# EasyEDA Pro project ProPrj_PRISM101 Scanner Backlight_2026-04-10.epro, board PRISM101 Backlight 4x4 RGBW 20260317
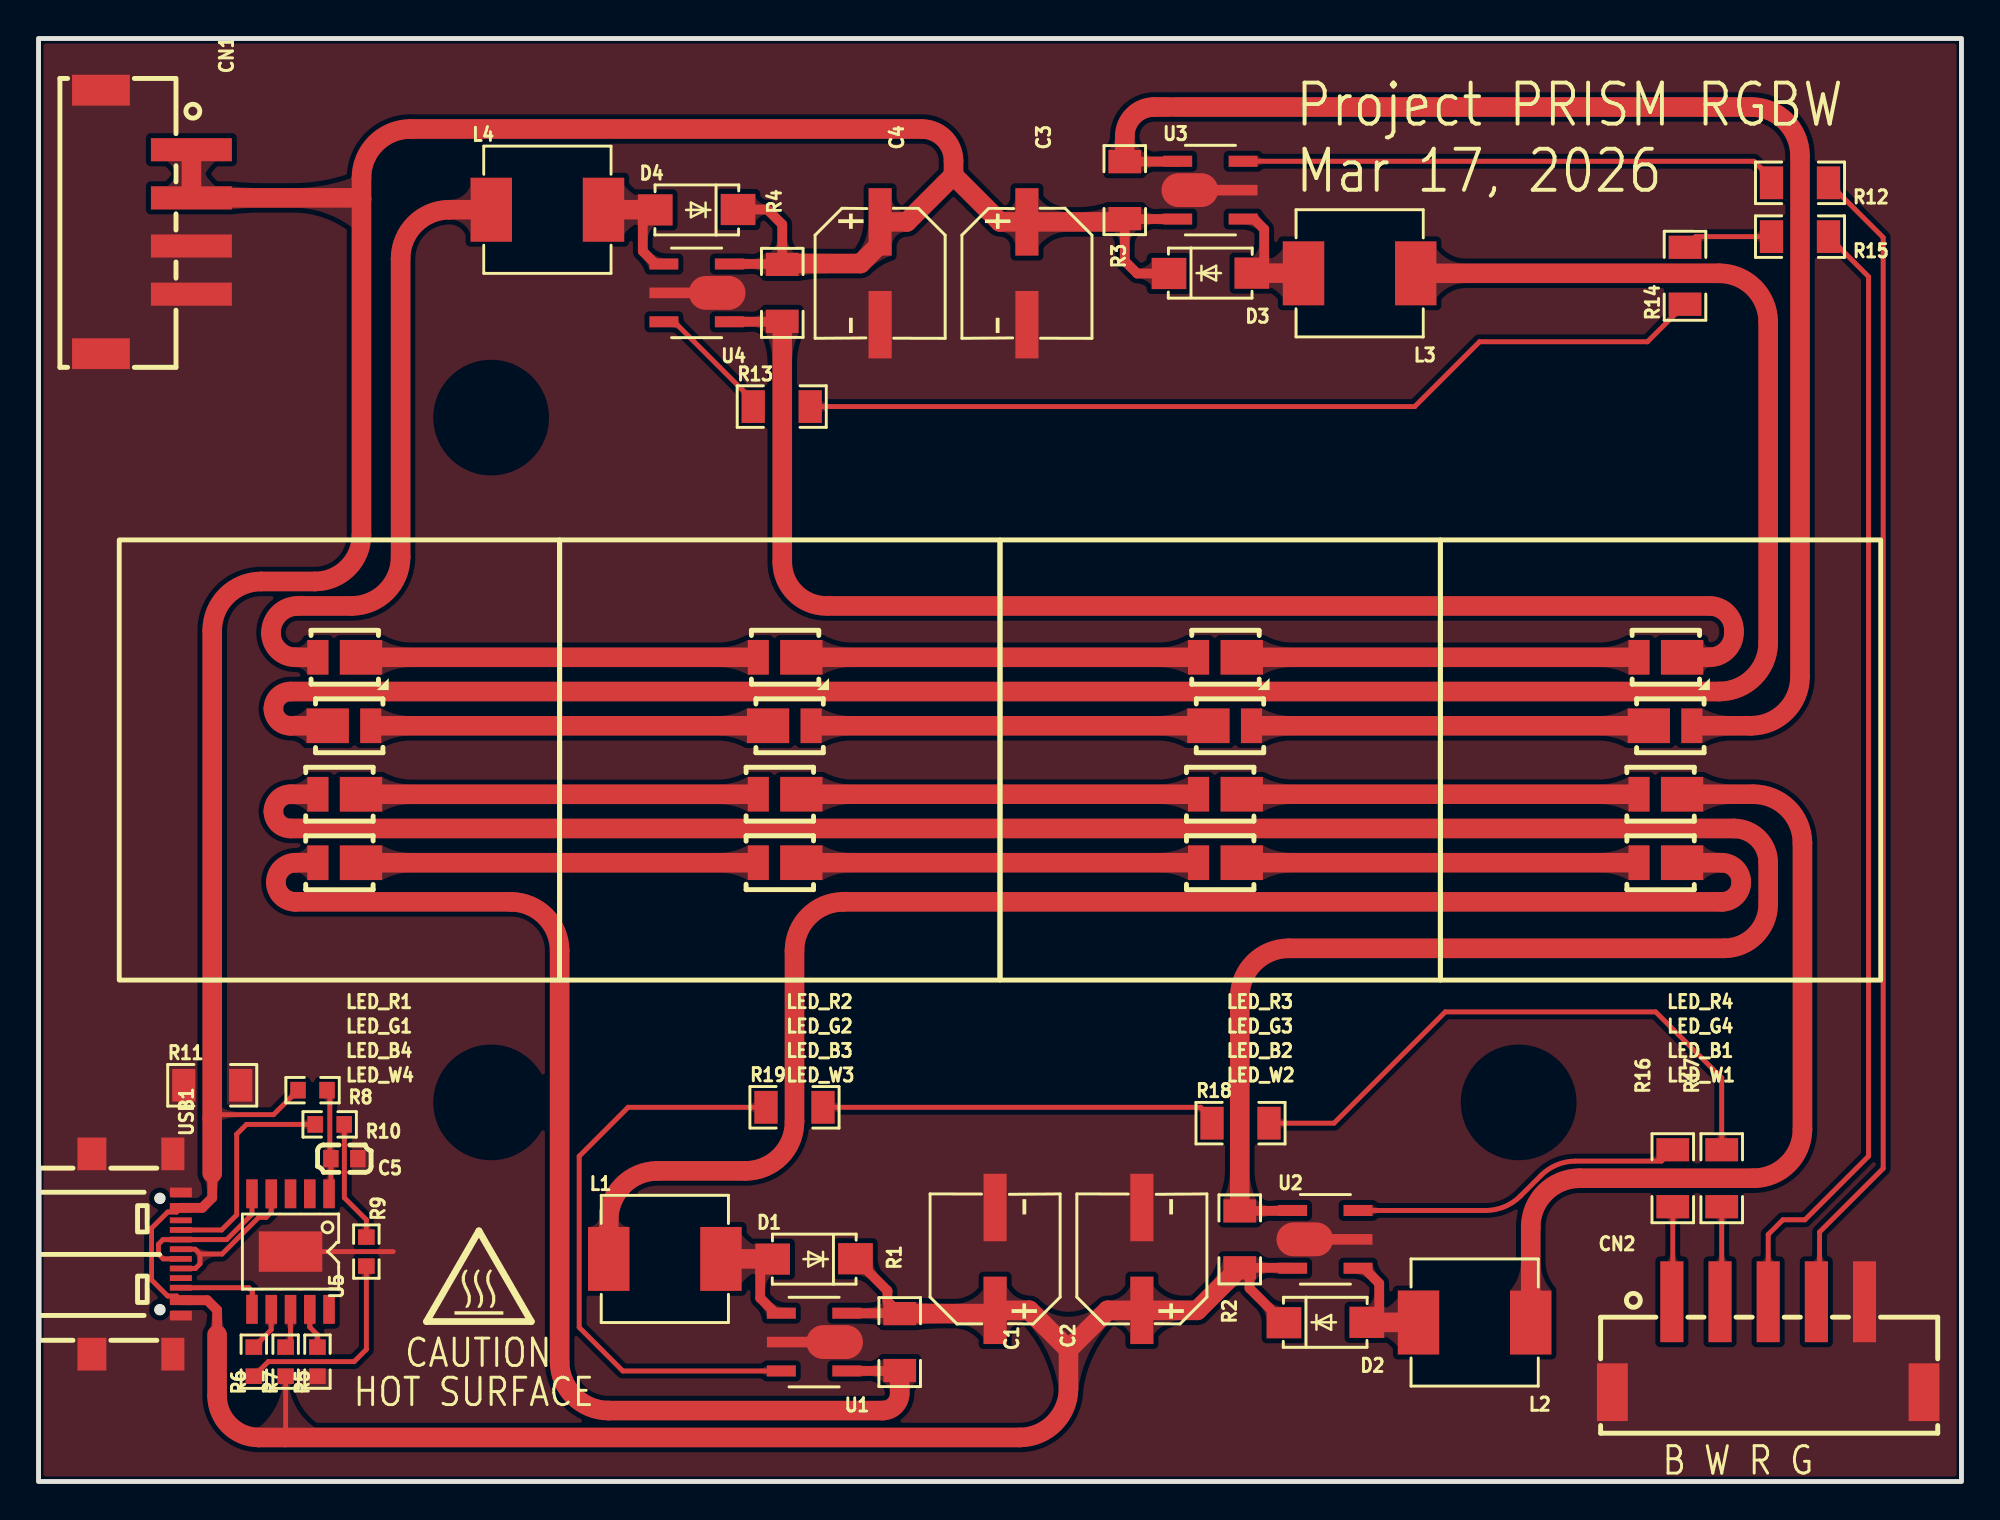
[diagram p3: board, top side]
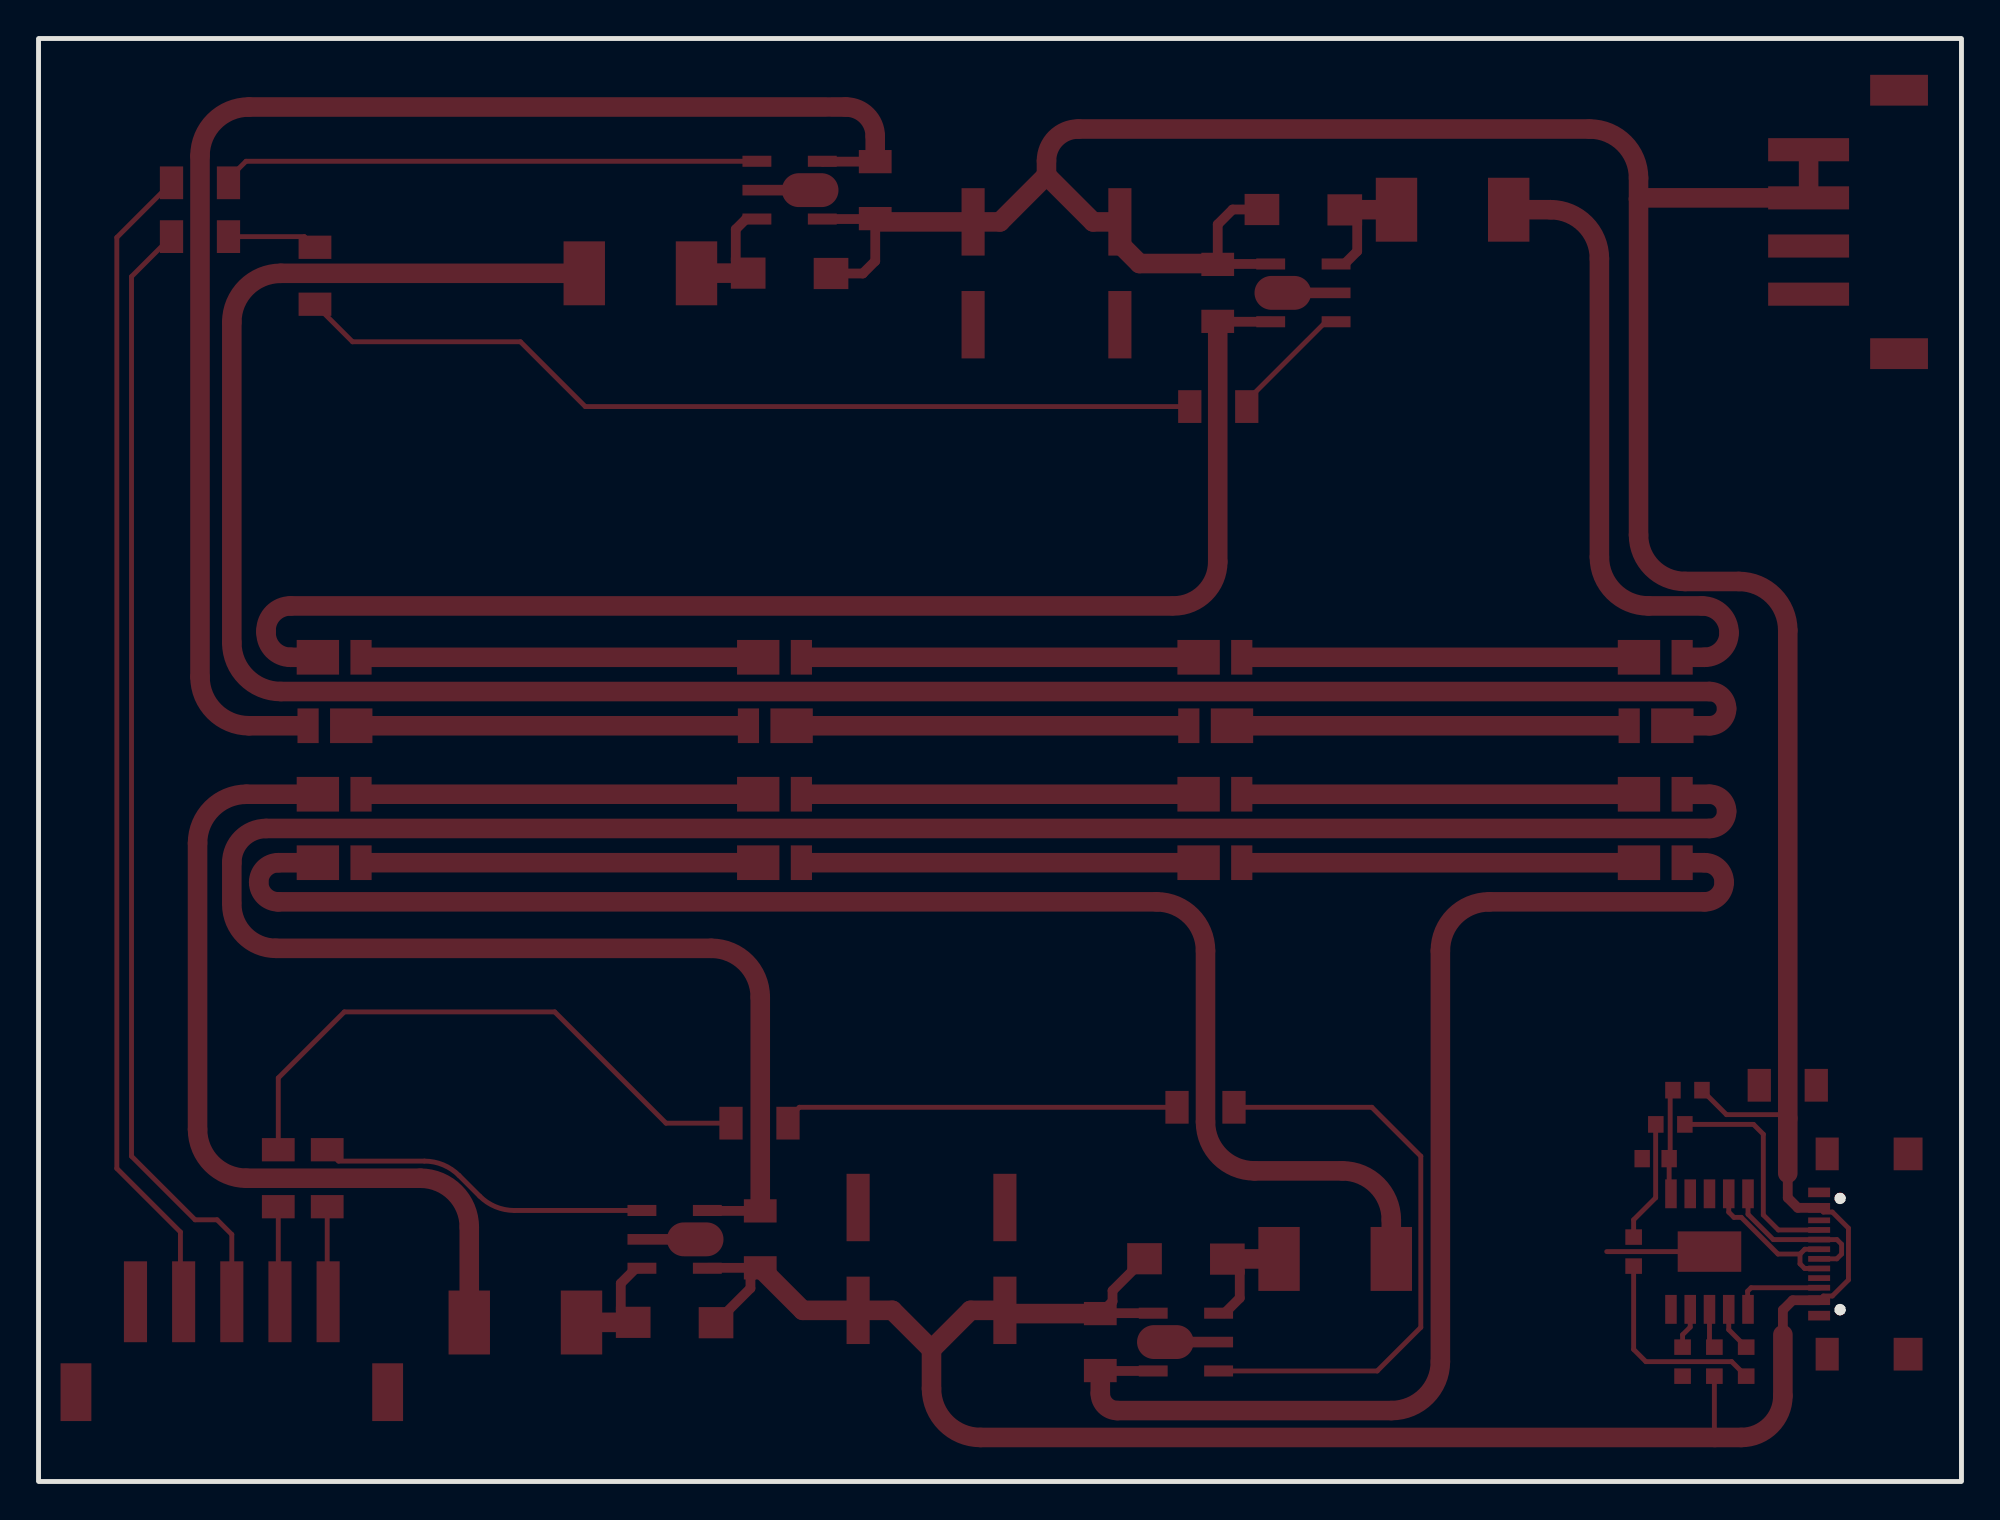
[diagram p4: board, bottom side, seen from below]

Outline 99.82 x 74.93 mm; copper layers: Top Layer, Bottom Layer. Coordinates in mm from the lower left corner of the outline.
Outline path: rectangle 0,74.93 99.82,0
Stack: Top Layer 0.035mm / Dielectric1 1.51mm FR4 er 4.5 / Bottom Layer 0.035mm

## Design rules (mm)
spacing copperThickness1oz (default): track to track 0.102, other pairs 0.152 to 0.3
spacing copperThickness2oz: track to track 0.203, other pairs 0.152 to 0.3
track width copperThickness1oz (default): min 0.127, default 0.254, max 2.54
track width copperThickness2oz: min 0.203, default 0.254, max 2.54
differential pair differentialPair (default): width min 0.127, default 0.254, max 2.54; gap min 0.152, default 0.152

## Placement (name value [footprint] x y rotation side)
C1  100uF  [CAP-SMD_BD6.3-L6.6-W6.6-LS7.3-FD-H7.7]  49.66 11.56 90 top
C2  100uF  [CAP-SMD_BD6.3-L6.6-W6.6-LS7.3-FD-H7.7]  57.28 11.56 90 top
C3  100uF  [CAP-SMD_BD6.3-L6.6-W6.6-LS7.3-FD-H7.7]  51.31 62.74 270 top
C4  100uF  [CAP-SMD_BD6.3-L6.6-W6.6-LS7.3-FD-H7.7]  43.69 62.74 270 top
C5  1uF  [C0603]  15.88 16.76 0 top
CN1  UK-2.54-4ALT  [CONN-SMD_UK-2.54-4ALT]  5.59 65.41 270 top
CN2  UK-2.54-5ALT  [CONN-SMD_5P-P2.50_UK-2.54-5ALT]  89.79 6.99 0 top
D1  SS36  [SMA_L4.3-W2.6-LS5.0-FD]  40.26 11.56 0 top
D2  SS36  [SMA_L4.3-W2.6-LS5.0-FD]  66.8 8.25 180 top
D3  SS36  [SMA_L4.3-W2.6-LS5.0-FD]  60.83 62.74 180 top
D4  SS36  [SMA_L4.3-W2.6-LS5.0-FD]  34.16 66.04 0 top
HOTSURFACE  CAUTION HOT SURFACE  [IEC_HotSurface_Small]  22.86 10.67 0 top
L1  68uH  [IND-SMD_L7.1-W6.6_H5.0]  32.51 11.56 0 top
L2  68uH  [IND-SMD_L7.1-W6.6_H5.0]  74.55 8.25 180 top
L3  68uH  [IND-SMD_L7.1-W6.6_H5.0]  68.58 62.74 180 top
L4  68uH  [IND-SMD_L7.1-W6.6_H5.0]  26.42 66.04 0 top
LED_B1  JE2835ARY-N-0002A0000-N0000001  [LED-SMD_L3.5-W2.8-JE2835BWT-N]  84.2 35.69 180 top
LED_B2  JE2835ARY-N-0002A0000-N0000001  [LED-SMD_L3.5-W2.8-JE2835BWT-N]  61.34 35.69 180 top
LED_B3  JE2835ARY-N-0002A0000-N0000001  [LED-SMD_L3.5-W2.8-JE2835BWT-N]  38.48 35.69 180 top
LED_B4  JE2835ARY-N-0002A0000-N0000001  [LED-SMD_L3.5-W2.8-JE2835BWT-N]  15.62 35.69 180 top
LED_G1  JE2835AGR-N-0002A0000-N0000001  [LED-SMD_L3.5-W2.8-JE2835BWT-N]  16.13 39.24 0 top
LED_G2  JE2835AGR-N-0002A0000-N0000001  [LED-SMD_L3.5-W2.8-JE2835BWT-N]  38.99 39.24 0 top
LED_G3  JE2835AGR-N-0002A0000-N0000001  [LED-SMD_L3.5-W2.8-JE2835BWT-N]  61.85 39.24 0 top
LED_G4  JE2835AGR-N-0002A0000-N0000001  [LED-SMD_L3.5-W2.8-JE2835BWT-N]  84.71 39.24 0 top
LED_R1  JE2835AHR-N-0001A0000-N0000001  [LED-SMD_L3.5-W2.8_JE2835APO-N-0001A0000-N0000001]  15.62 42.8 0 top
LED_R2  JE2835AHR-N-0001A0000-N0000001  [LED-SMD_L3.5-W2.8_JE2835APO-N-0001A0000-N0000001]  38.48 42.8 0 top
LED_R3  JE2835AHR-N-0001A0000-N0000001  [LED-SMD_L3.5-W2.8_JE2835APO-N-0001A0000-N0000001]  61.34 42.8 0 top
LED_R4  JE2835AHR-N-0001A0000-N0000001  [LED-SMD_L3.5-W2.8_JE2835APO-N-0001A0000-N0000001]  84.2 42.8 0 top
LED_W1  JE2835BWT-N-U65EA0000-N0000001  [LED-SMD_L3.5-W2.8-JE2835BWT-N]  84.2 32.13 180 top
LED_W2  JE2835BWT-N-U65EA0000-N0000001  [LED-SMD_L3.5-W2.8-JE2835BWT-N]  61.34 32.13 180 top
LED_W3  JE2835BWT-N-U65EA0000-N0000001  [LED-SMD_L3.5-W2.8-JE2835BWT-N]  38.48 32.13 180 top
LED_W4  JE2835BWT-N-U65EA0000-N0000001  [LED-SMD_L3.5-W2.8-JE2835BWT-N]  15.62 32.13 180 top
R1  0.3R  [R1206]  44.7 7.24 270 top
R2  0.3R  [R1206]  62.36 12.57 90 top
R3  0.3R  [R1206]  56.39 67.06 90 top
R4  0.3R  [R1206]  38.61 61.72 270 top
R5  NC / 120K  [R0603]  14.48 6.22 270 top
R6  0R  [R0603]  11.18 6.22 90 top
R7  10K / 0R  [R0603]  12.83 6.22 270 top
R8  1K / 0R  [R0603]  14.22 20.32 0 top
R9  0R  [R0603]  17.02 11.94 90 top
R10  0R  [R0603]  15.11 18.54 180 top
R11  0R  [R1206]  9.02 20.57 0 top
R12  0R  [R1206]  91.44 67.44 0 top
R13  0R  [R1206]  38.58 55.82 0 top
R14  0R  [R1206]  85.47 62.61 90 top
R15  0R  [R1206]  91.44 64.64 0 top
R16  0R  [R1206]  84.84 15.75 270 top
R17  0R  [R1206]  87.38 15.75 270 top
R18  0R  [R1206]  62.4 18.61 0 top
R19  0R  [R1206]  39.24 19.43 0 top
U1  PT4115  [SOT-89-5_L4.5-W2.5-P1.50-LS4.5-BR]  40.26 7.24 180 top
U2  PT4115  [SOT-89-5_L4.5-W2.5-P1.50-LS4.5-BR]  66.8 12.57 0 top
U3  PT4115  [SOT-89-5_L4.5-W2.5-P1.50-LS4.5-BR]  60.83 67.06 0 top
U4  PT4115  [SOT-89-5_L4.5-W2.5-P1.50-LS4.5-BR]  34.16 61.72 180 top
U5  CH224K / CH224A  [ESSOP-10_L4.9-W3.9-P1.0-LS6.0-TL-EP]  13.08 11.94 180 top
USB1  TYPE-C 16P QTWT  [USB-TYPE-C-SMD_TYPE-C-16P-QTWT]  5.08 11.81 270 top

## Footprints (pads in the part's own frame, mm; a bottom-side part is the same pattern mirrored in y, then rotated)
C0603
  rect 0.8x0.9 smd: 1(-0.7,0) 2(0.7,0)
CAP-SMD_BD6.3-L6.6-W6.6-LS7.3-FD-H7.7
  rect 3.5x1.2 smd: 1(-2.67,0) 2(2.67,0)
CONN-SMD_5P-P2.50_UK-2.54-5ALT
  rect 1.2x4.2 smd: 1(-5,2.348) 2(-2.5,2.348) 3(0,2.348) 4(2.5,2.348) 5(5,2.348)
  rect 1.6x3 smd: 6(8.09,-2.348) 7(-8.09,-2.348)
CONN-SMD_UK-2.54-4ALT
  rect 1.2x4.2 smd: 1(-3.75,2.348) 2(-1.25,2.348) 3(1.25,2.348) 4(3.75,2.348)
  rect 1.6x3 smd: 5(6.84,-2.348) 6(-6.84,-2.348)
ESSOP-10_L4.9-W3.9-P1.0-LS6.0-TL-EP
  rect 0.6x1.5 smd: 1(-2,-3) 2(-1,-3) 3(0,-3) 4(1,-3) 5(2,-3) 6(2,3) 7(1,3) 8(0,3) 9(-1,3) 10(-2,3)
  rect 3.3x2.1 smd: 11(0,0)
IND-SMD_L7.1-W6.6_H5.0
  rect 2.15x3.32 smd: 1(-2.913,0) 2(2.913,0)
LED-SMD_L3.5-W2.8-JE2835BWT-N
  rect 2.2x1.8 smd: 1(-1.12,0)
  rect 1.1x1.8 smd: 2(1.12,0)
LED-SMD_L3.5-W2.8_JE2835APO-N-0001A0000-N0000001
  rect 1.1x1.8 smd: 1(-1.12,0)
  rect 2.2x1.8 smd: 2(1.12,0)
R0603
  rect 0.806x0.864 smd: 1(-0.753,0) 2(0.753,0)
R1206
  rect 1.208x1.701 smd: 1(-1.479,0) 2(1.479,0)
SMA_L4.3-W2.6-LS5.0-FD
  rect 1.8x1.62 smd: 1(-2.15,-0.009) 2(2.15,0.009)
SOT-89-5_L4.5-W2.5-P1.50-LS4.5-BR
  rect 1.5x0.574 smd: 1(1.698,-1.5) 3(1.698,1.5) 4(-1.698,1.5) 5(-1.698,-1.5)
  oval 2.94x1.76 smd: 2(-1.067,0)
  rect 2.209x0.552 smd: 2(1.343,0)
USB-TYPE-C-SMD_TYPE-C-16P-QTWT
  rect 1.7x1.2 smd: 0(-5.2,1.891) 0(5.2,1.891)
  rect 1.7x1.5 smd: 0(-5.2,-2.309) 0(5.2,-2.309)
  rect 0.5x1.14 smd: A1(-3.2,2.308) A4(-2.4,2.308) A9(2.4,2.308) A12(3.2,2.308)
  rect 0.3x1.14 smd: A5(-1.25,2.308) A6(-0.25,2.308) A7(0.25,2.308) A8(1.25,2.309) B5(1.75,2.308) B6(0.75,2.308) B7(-0.75,2.308) B8(-1.75,2.309)

## Nets
As in the schematic.

Pads without a net: U5 2 3 10; USB1 A8 B8

## Routing (per net, layer and track width the routed paths; a pad name or vN(x,y) marks a point on that pad's centre or on a via; arc(x,y) is an arc through that point)
GND: length 5.3
  Top Layer w0.254: U5.11 18.42,11.94
VCC: length 245.5
  Top Layer w0.254: R7.2 12.83,2.31 arc(12.82,2.29) 12.8,2.29 ; USB1.A9 7.17,9.63 6.7,9.63 5.87,10.47 5.87,13.15 6.7,13.99 7.17,13.99 USB1.A4 ; R8.1 12.2,19.05 9.21,19.05 9.02,18.85
  Top Layer w0.508: 36.31,66.05 37.84,66.05 38.61,65.28 R4.1 38.59,63.22 U4.5 ; D1.2 44.07,9.91 44.07,9.35 44.68,8.74 ; U1.5 44.68,8.74 ; 44.68,8.74 R1.1 ; D2.2 62.87,10.03 62.87,10.59 R2.1 65.08,11.09 U2.5 ; USB1.A9 8.76,9.41 9.27,8.9 9.27,7.62 ; 9.02,16 9.02,14.73 8.5,14.21 USB1.A4 ; R3.1 56.39,63.37 57.03,62.73 D3.2 ; U3.5 56.41,65.56
  Top Layer w1.016: 16.76,66.6 16.71,66.66 CN1.2 CN1.1 ; 16.76,66.6 16.76,67.69 arc(17.51,69.49) 19.3,70.23 45.85,70.23 arc(47.01,69.75) 47.5,68.58 47.5,67.95 arc(47.5,67.89) 47.5,67.82 ; 16.76,66.6 16.76,49.15 arc(16.06,47.44) 14.35,46.74 11.56,46.74 arc(9.76,45.99) 9.02,44.2 9.02,16 ; 47.5,67.82 45.08,65.41 C4.1 43.69,64.26 42.67,63.25 38.65,63.25 R4.1 ; 47.5,67.82 49.91,65.41 C3.1 56.22,65.41 ; 53.47,6.86 51.44,8.89 49.66,8.89 49.49,8.72 R1.1 ; 53.47,6.86 53.47,4.83 arc(52.72,3.03) 50.93,2.29 11.43,2.29 arc(9.9,2.92) 9.27,4.44 9.27,7.62 ; 53.47,6.86 55.5,8.89 60.15,8.89 R2.1
VDD: length 5.4
  Top Layer w0.254: U5.1 15.17,15.03 C5.1 15.12,16.82 15.12,20.32
DIM_B: length 17.4
  Top Layer w0.254: 84.84,17.23 84.25,16.64 79.79,16.64 arc(78.82,16.44) 78,15.89 76.92,14.82 arc(76.1,14.27) 75.12,14.07 U2.3
DIM_G: length 28
  Top Layer w0.254: R12.1 89.96,67.65 89.05,68.56 U3.3
DIM_R: length 6.6
  Top Layer w0.254: U4.3 33,60.22 37.1,56.12 R13.1
DIM_W: length 31.1
  Top Layer w0.254: R19.1 30.61,19.43 28.07,16.89 28.07,8 30.33,5.74 U1.3
PD_USB_CC1: length 11.6
  Top Layer w0.254: USB1.A5 9.5,13.06 10.29,13.84 10.29,18.03 10.8,18.54 14.23,18.54
PD_USB_CC2: length 4.8
  Top Layer w0.254: 7.33,10.06 10.92,10.06 11.1,9.88 11.1,8.96 U5.6
PD_USB_DM: length 8.3
  Top Layer w0.254: U5.5 11.08,13.88 9.77,12.56 USB1.B7 6.47,12.56 6.22,12.32 6.22,11.81 6.47,11.56 7.33,11.56
PD_USB_DP: length 8.4
  Top Layer w0.254: 7.33,11.06 8.14,11.06 8.38,11.3 8.38,11.81 ; U5.4 12.08,13.99 11.81,13.72 11.43,13.72 9.53,11.81 8.38,11.81 ; 8.38,11.81 8.13,12.06 7.33,12.06
$1N1: length 20.6
  Top Layer w1.016: LED_R4.1 LED_R3.2
$1N2: length 20.6
  Top Layer w1.016: LED_R3.1 LED_R2.2
$1N3: length 20.6
  Top Layer w1.016: LED_R1.2 LED_R2.1
$1N6: length 70.1
  Top Layer w0.508: R4.2 38.59,60.22 U4.4
  Top Layer w1.016: R4.2 38.61,47.75 arc(39.28,46.14) 40.89,45.47 ; LED_R4.2 86.74,42.8 arc(87.64,43.17) 88.01,44.07 88.01,44.2 arc(87.64,45.09) 86.74,45.47 41.02,45.47
$1N14: length 6.2
  Top Layer w0.508: 31.37,66.03 31.37,63.88 32.03,63.22 U4.1
  Top Layer w1.016: D4.1 32,66.04 L4.2
$1N15: length 33.8
  Top Layer w1.016: LED_R1.1 13.33,42.8 arc(12.44,43.17) 12.06,44.07 arc(12.47,45.06) 13.46,45.47 16.26,45.47 arc(18.05,46.21) 18.8,48.01 18.8,63.5 arc(19.54,65.3) 21.34,66.04 L4.1
$1N18: length 75.3
  Top Layer w0.508: U3.4 59.12,68.54 R3.2
  Top Layer w1.016: 58.67,71.37 57.91,71.37 arc(56.83,70.93) 56.39,69.85 R3.2 ; 58.93,71.37 88.9,71.37 arc(90.7,70.63) 91.44,68.83 91.44,41.78 arc(90.7,39.99) 88.9,39.24 LED_G4.2
$1N19: length 6.5
  Top Layer w0.508: U3.1 63.09,65.56 63.63,65.02 63.63,63.39 D3.1
  Top Layer w1.016: 65.67,62.74 65.66,62.75 D3.1
$1N20: length 119.3
  Top Layer w1.016: L3.1 87.25,62.74 arc(89.05,61.99) 89.79,60.2 89.79,43.56 arc(89.05,41.76) 87.25,41.02 13.08,41.02 arc(12.45,40.76) 12.19,40.13 arc(12.45,39.5) 13.08,39.24 LED_G1.1
$1N22: length 20.6
  Top Layer w1.016: 17.25,39.24 LED_G2.1
$1N23: length 20.6
  Top Layer w1.016: LED_G2.2 LED_G3.1
$1N24: length 20.6
  Top Layer w1.016: LED_G4.1 LED_G3.2
$1N28: length 128
  Top Layer w0.508: U2.4 65.08,14.05 R2.2
  Top Layer w1.016: R2.2 62.36,25.15 arc(63.1,26.94) 64.9,27.69 87.5,27.69 arc(89.12,28.36) 89.79,29.97 ; LED_B4.2 13.08,35.69 arc(12.45,35.43) 12.19,34.8 arc(12.45,34.17) 13.08,33.91 88.01,33.91 arc(89.27,33.39) 89.79,32.13 89.79,30.1
$1N29: length 6.4
  Top Layer w0.508: U2.1 68.81,11.07 69.6,10.29 69.6,8.91 D2.1
  Top Layer w1.016: D2.1 71.63,8.26 L2.2
$1N30: length 44.5
  Top Layer w1.016: LED_B1.1 89.03,35.69 arc(90.82,34.94) 91.57,33.15 91.57,18.29 arc(90.82,16.49) 89.03,15.75 80,15.75 arc(78.21,15) 77.46,13.21 L2.1
$1N32: length 20.6
  Top Layer w1.016: LED_B1.2 62.46,35.69
$1N33: length 20.6
  Top Layer w1.016: LED_B2.2 39.6,35.69
$1N34: length 20.6
  Top Layer w1.016: LED_B3.2 37.36,35.69 LED_B4.1
$1N38: length 64.4
  Top Layer w0.508: R1.2 44.68,5.74 U1.4
  Top Layer w1.016: R1.2 44.7,4.57 arc(44.44,3.94) 43.81,3.68 29.59,3.68 arc(27.79,4.43) 27.05,6.22 27.05,27.56 arc(26.31,29.36) 24.51,30.1 13.33,30.1 arc(12.62,30.4) 12.32,31.12 arc(12.62,31.83) 13.33,32.13 LED_W4.2
$1N39: length 6.4
  Top Layer w0.508: U1.1 38.25,8.74 37.47,9.53 37.47,10.9 D1.1
  Top Layer w1.016: L1.2 38.1,11.56 D1.1
$1N40: length 78.3
  Top Layer w1.016: LED_W1.1 87.38,32.13 arc(88.09,31.83) 88.39,31.12 arc(88.09,30.4) 87.38,30.1 41.78,30.1 arc(39.99,29.36) 39.24,27.56 39.24,18.67 arc(38.5,16.87) 36.7,16.13 32.14,16.13 arc(30.34,15.39) 29.6,13.59 L1.1
$1N42: length 20.6
  Top Layer w1.016: LED_W2.1 83.08,32.13
$1N43: length 20.6
  Top Layer w1.016: LED_W3.1 LED_W2.2
$1N44: length 20.6
  Top Layer w1.016: LED_W4.1 37.36,32.13
$1N66: length 2.1
  Top Layer w0.254: R5.1 14.48,7.62 14.08,8.02 U5.9
$1N75: length 2.3
  Top Layer w0.254: R6.2 12.08,7.88 U5.7
$1N76: length 2.1
  Top Layer w0.254: U5.8 13.08,7.23 R7.1
$1N80: length 6.3
  Top Layer w0.254: R10.1 15.88,18.53 15.88,14.73 17.02,13.59 R9.2
$1N82: length 10.7
  Top Layer w0.254: R9.1 17.02,6.86 16.38,6.22 11.93,6.22 R6.1
$1N102: length 60.7
  Top Layer w0.254: CN2.4 92.46,9.5 92.46,12.95 95.76,16.26 95.76,64.6 R12.2
$1N104: length 47.6
  Top Layer w0.254: R14.1 83.52,59.18 74.8,59.18 71.44,55.82 40.06,55.82
$1N105: length 4.7
  Top Layer w0.254: R15.1 86.02,64.64 R14.2
$1N106: length 59
  Top Layer w0.254: CN2.3 89.79,12.83 90.55,13.59 91.69,13.59 95,16.89 95,62.57 R15.2
$1N110: length 5
  Top Layer w0.254: R17.2 87.38,9.42 CN2.2
$1N111: length 5
  Top Layer w0.254: CN2.1 84.84,9.38 R16.2
$1N112: length 31
  Top Layer w0.254: 87.38,17.23 87.38,20.96 83.95,24.38 73.03,24.38 67.25,18.61 R18.2
$1N114: length 20.7
  Top Layer w0.254: R19.2 60.32,19.43 60.92,18.84 R18.1

## Copper pours and planes (outline as drawn; the poured copper is in the pictures)
GND on Top Layer: -2.41,77.34 103.25,77.34 103.25,-3.56 -2.41,-3.56

Small or netless copper shapes (teardrops, artwork), in the pictures only: 155 on Top Layer

## Text on the board
Top Silkscreen Layer: HOT SURFACE | CAUTION | B W R G | Project PRISM RGBW / Mar 17, 2026
